# EAGLE design IMU (EAGLE 9.6.2)
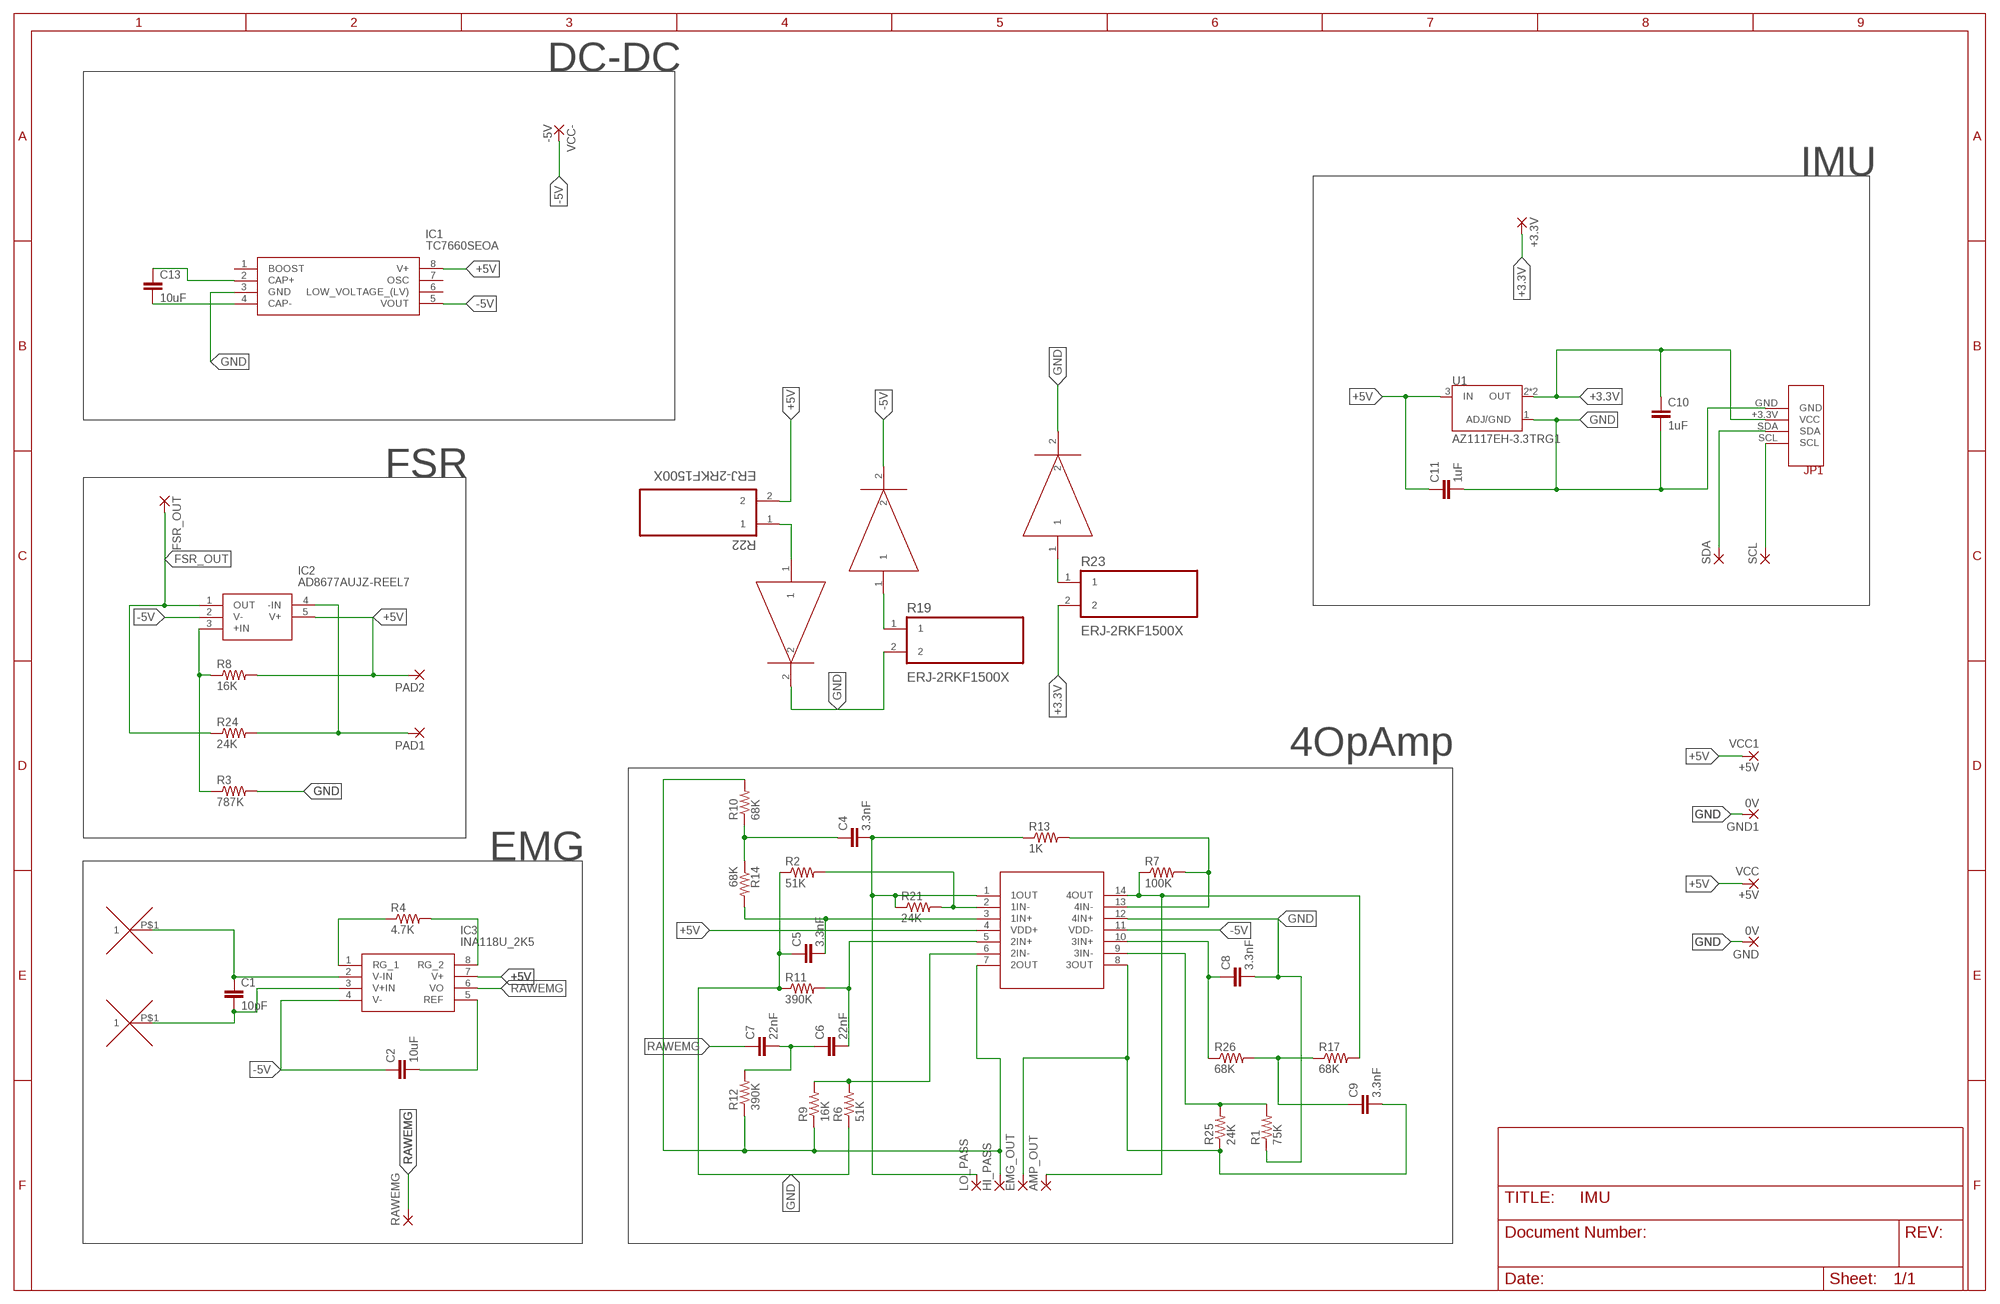
[diagram p0: schematic, sheet 1]

## Parts
+3.3V  1,6/0,8  [1,6/0,8]
AMP_OUT  1,6/0,8  [1,6/0,8]
BLUE  RESC0402X40N  [RESC0402X40N]
C1  10pF  C-EUHPC0201  [HPC0201]
C2  10uF  C-EUC0805  [C0805]
C4  3.3nF  C-EUC1206  [C1206]
C5  3.3nF  C-EUC1206  [C1206]
C6  22nF  C-EUC0805  [C0805]
C7  22nF  C-EUC0805  [C0805]
C8  3.3nF  C-EUC1206  [C1206]
C9  3.3nF  C-EUC1206  [C1206]
C10  1uF  C-EUC0402  [C0402]
C11  1uF  C-EUC0402  [C0402]
C13  10uF  C-EUC0805K  [C0805K]
EMG_OUT  1,6/0,8  [1,6/0,8]
FSR_OUT  1,6/0,8  [1,6/0,8]
GND  0V  1,6/0,8  [1,6/0,8]
GND1  0V  1,6/0,8  [1,6/0,8]
HI_PASS  1,6/0,8  [1,6/0,8]
IC1  TC7660SEOA  [SOIC127P600X175-8N]
IC2  AD8677AUJZ-REEL7  [SOT95P280X100-5N]
IC3  INA118U_2K5  [SOIC127P600X175-8N]
IMU  IMU  [IMU]
LO_PASS  1,6/0,8  [1,6/0,8]
ORANGE  RESC0402X40N  [RESC0402X40N]
PAD1  SMD2  [SMD1,27-2,54]
PAD2  SMD2  [SMD1,27-2,54]
R1  75K  R-US_R0402  [R0402]
R2  51K  R-US_R0402  [R0402]
R3  787K  R-US_R0805  [R0805]
R4  4.7K  R-US_R0402  [R0402]
R6  51K  R-US_R0402  [R0402]
R7  100K  R-US_R1005  [R1005]
R8  16K  R-US_R0402  [R0402]
R9  16K  R-US_R0402  [R0402]
R10  68K  R-US_R0402  [R0402]
R11  390K  R-US_R0603  [R0603]
R12  390K  R-US_R0603  [R0603]
R13  1K  R-US_R0402  [R0402]
R14  68K  R-US_R0402  [R0402]
R17  68K  R-US_R0402  [R0402]
R19  ERJ-2RKF1500X  [RESC1005X40N]
R21  24K  R-US_R0402  [R0402]
R22  ERJ-2RKF1500X  [RESC1005X40N]
R23  ERJ-2RKF1500X  [RESC1005X40N]
R24  24K  R-US_R0402  [R0402]
R25  24K  R-US_R0402  [R0402]
R26  68K  R-US_R0402  [R0402]
RAWEMG  1,6/0,8  [1,6/0,8]
RED  RESC0402X40N  [RESC0402X40N]
SCL  1,6/0,8  [1,6/0,8]
SDA  1,6/0,8  [1,6/0,8]
U1  AZ1117EH-3.3TRG1  [SOT230P700X180-4N]
U$1  TLC2274-HT  [SOP65P640X120-14N]
U$2  EMG_VIA  [EMG_VIA]
U$3  EMG_VIA  [EMG_VIA]
VCC  +5V  1,6/0,8  [1,6/0,8]
VCC1  +5V  1,6/0,8  [1,6/0,8]
VCC-  -5V  1,6/0,8  [1,6/0,8]

## Nets
+3.3V: +3.3V.1(P) C10.1 IMU.+3.3V(VCC) R23.2 U1.2(OUT) U1.4(OUT)
+5V: C11.1 IC1.8(V+) IC2.5(V+) IC3.7(V+) PAD2.1(P) R8.2 R22.2 U1.3(IN) U$1.4(VDD+) VCC1.1(P) VCC.1(P)
-5V: BLUE.2 C2.1 IC1.5(VOUT) IC2.2(V-) IC3.4(V-) U$1.11(VDD-) VCC-.1(P)
EMG_BASIC: C9.2 EMG_OUT.1(P) R25.1 U$1.8(3OUT)
FSR_OUT: FSR_OUT.1(P) IC2.1(OUT) R24.1
GND: C5.1 C8.2 C10.2 C11.2 GND1.1(P) GND.1(P) IC1.3(GND) IMU.GND ORANGE.2 R1.1 R2.1 R3.2 R6.1 R11.1 R19.2 RED.2 U1.1(ADJ/GND) U$1.12(4IN+)
N$1: C13.1 IC1.2(CAP+)
N$2: C13.2 IC1.4(CAP-)
N$3: C1.1 IC3.2(V-IN) U$2.P$1
N$4: R22.1 RED.1
N$5: C1.2 IC3.3(V+IN) U$3.P$1
N$6: BLUE.1 R19.1
N$7: IC2.4(-IN) PAD1.1(P) R24.2
N$9: ORANGE.1 R23.1
N$10: IC2.3(+IN) R3.1 R8.1
N$11: C2.2 IC3.5(REF)
N$12: IC3.1(RG_1) R4.1
N$13: IC3.8(RG_2) R4.2
N$14: C4.2 LO_PASS.1(P) R13.1 R21.1 U$1.1(1OUT)
N$16: IMU.SDA SDA.1(P)
N$17: AMP_OUT.1(P) R7.1 R17.2 U$1.14(4OUT)
N$18: R7.2 R13.2 U$1.13(4IN-)
N$19: R2.2 R21.2 U$1.2(1IN-)
N$20: C5.2 R14.2 U$1.3(1IN+)
N$21: C4.1 R10.1 R14.1
N$22: IMU.SCL SCL.1(P)
N$23: C6.1 C7.2 R12.2
N$24: C6.2 R11.2 U$1.5(2IN+)
N$26: R6.2 R9.2 U$1.6(2IN-)
N$27: C9.1 R17.1 R26.2
N$28: C8.1 R26.1 U$1.10(3IN+)
N$30: R1.2 R25.2 U$1.9(3IN-)
PIN7: HI_PASS.1(P) R9.1 R10.2 R12.1 U$1.7(2OUT)
RAWEMG: C7.1 IC3.6(VO) RAWEMG.1(P)
Unconnected: IC1.1(BOOST) IC1.6(LOW_VOLTAGE_(LV)) IC1.7(OSC)

## Notes on the sheet
- DC-DC
- IMU
- FSR
- 4OpAmp
- EMG

## Library data of the parts
+3.3V AMP_OUT EMG_OUT FSR_OUT GND GND1 HI_PASS LO_PASS RAWEMG SCL SDA VCC VCC1 VCC- = wirepad:1,6/0,8: THROUGH-HOLE PAD
BLUE ORANGE RED = RESC0402X40N:RESC0402X40N; A_MAX: 0.4; A_MIN: 0.4; A_NOM: 0.4; D_MAX: 1.1; D_MIN: 0.95; D_NOM: 1.0; E_MAX: 0.55; E_MIN: 0.45; E_NOM: 0.5; L1_MAX: 0.3; L1_MIN: 0.15; L1_NOM: 0.25; L_MAX: 0.3; L_MIN: 0.15; L_NOM: 0.25; MANUFACTURER: KOA; STANDARD: IPC 7351B
C1 C2 C4-C11 C13 = rcl:C-EU: CAPACITOR, European symbol; SPICEPREFIX: C
IC1 = TC7660SEOA:TC7660SEOA: DC-TO-DC VOLTAGE CONVERTER Source: Datasheet <http://componentsearchengine.com/Datasheets/1/TC7660SEOA.pdf>; ARROW_PART_NUMBER: TC7660SEOA; ARROW_PRICE-STOCK: https://www.arrow.com/en/products/tc7660seoa/microchip-technology; DESCRIPTION: DC-TO-DC VOLTAGE CONVERTER; HEIGHT: 1.75mm; MANUFACTURER_NAME: Microchip; MANUFACTURER_PART_NUMBER: TC7660SEOA; MOUSER_PART_NUMBER: 579-TC7660SEOA; MOUSER_PRICE-STOCK: https://www.mouser.co.uk/ProductDetail/Microchip-Technology/TC7660SEOA?qs=cQYLKLPzRJl3hJI5k2EAHg%3D%3D
IC2 = AD8677AUJZ-REEL7:AD8677AUJZ-REEL7: Precision Amplifiers 130uV Max Offset VTG Source: Datasheet <http://www.analog.com/media/en/technical-documentation/data-sheets/AD8677.pdf>; ARROW_PART_NUMBER: AD8677AUJZ-REEL7; ARROW_PRICE-STOCK: https://www.arrow.com/en/products/ad8677aujz-reel7/analog-devices; DESCRIPTION: Precision Amplifiers 130uV Max Offset VTG; HEIGHT: 1mm; MANUFACTURER_NAME: Analog Devices; MANUFACTURER_PART_NUMBER: AD8677AUJZ-REEL7; MOUSER_PART_NUMBER: 584-AD8677AUJZ-R7; MOUSER_PRICE-STOCK: https://www.mouser.co.uk/ProductDetail/Analog-Devices/AD8677AUJZ-REEL7?qs=%2FtpEQrCGXCxIKHu%2FfOAijA%3D%3D
IC3 = INA118U_2K5:INA118U_2K5: Precision, Low Power Instrumentation Amplifier Source: Datasheet <http://www.ti.com/lit/gpn/INA118>; ARROW_PART_NUMBER: INA118U/2K5; ARROW_PRICE-STOCK: https://www.arrow.com/en/products/ina118u2k5/texas-instruments; DESCRIPTION: Precision, Low Power Instrumentation Amplifier; HEIGHT: 1.75mm; MANUFACTURER_NAME: Texas Instruments; MANUFACTURER_PART_NUMBER: INA118U/2K5; MOUSER_PART_NUMBER: 595-INA118U/2K5; MOUSER_PRICE-STOCK: https://www.mouser.co.uk/ProductDetail/Texas-Instruments/INA118U-2K5?qs=VBduBm9rCJRVtE6eJbSA%2Fg%3D%3D
IMU = IMU:IMU
PAD1 PAD2 = wirepad:SMD2: SMD PAD
R1 R2 R6 R8-R11 R13 R14 R17 R21 R24-R26 = adafruit:R-US_: RESISTOR, American symbol
R3 = rcl:R-US_: RESISTOR, American symbol; SPICEPREFIX: R
R4 R7 R12 = adafruit@1:R-US_: RESISTOR, American symbol
R19 R22 R23 = ERJ-2RKF1500X:ERJ-2RKF1500X; DESCRIPTION: 150 Ohms ±1% 0.1W, 1/10W Chip Resistor 0402 (1005 Metric) Automotive AEC-Q200 Thick Film; DIGI-KEY_PART_NUMBER: P150LCT-ND; MF: Panasonic Electronic; MP: ERJ-2RKF1500X; PACKAGE: 1005 Panasonic Electronic Components; PURCHASE-URL: https://pricing.snapeda.com/search/part/ERJ-2RKF1500X/?ref=eda
U1 = AZ1117EH-3.3TRG1:AZ1117EH-3.3TRG1: Ldo.Vreg Pos 3, 3v 1a Sot223; DESCRIPTION: Linear Voltage Regulator IC 1 Output 1A SOT-223; DIGI-KEY_PART_NUMBER: AZ1117EH-3.3TRG1DICT-ND; MF: Diodes Inc.; MP: AZ1117EH-3.3TRG1; PACKAGE: SOT-223 Diodes Inc.; PURCHASE-URL: https://pricing.snapeda.com/search/part/AZ1117EH-3.3TRG1/?ref=eda
U$1 = TLC2274-HT:TLC2274-HT
U$2 U$3 = EMG_VIA:EMG_VIA

## Board
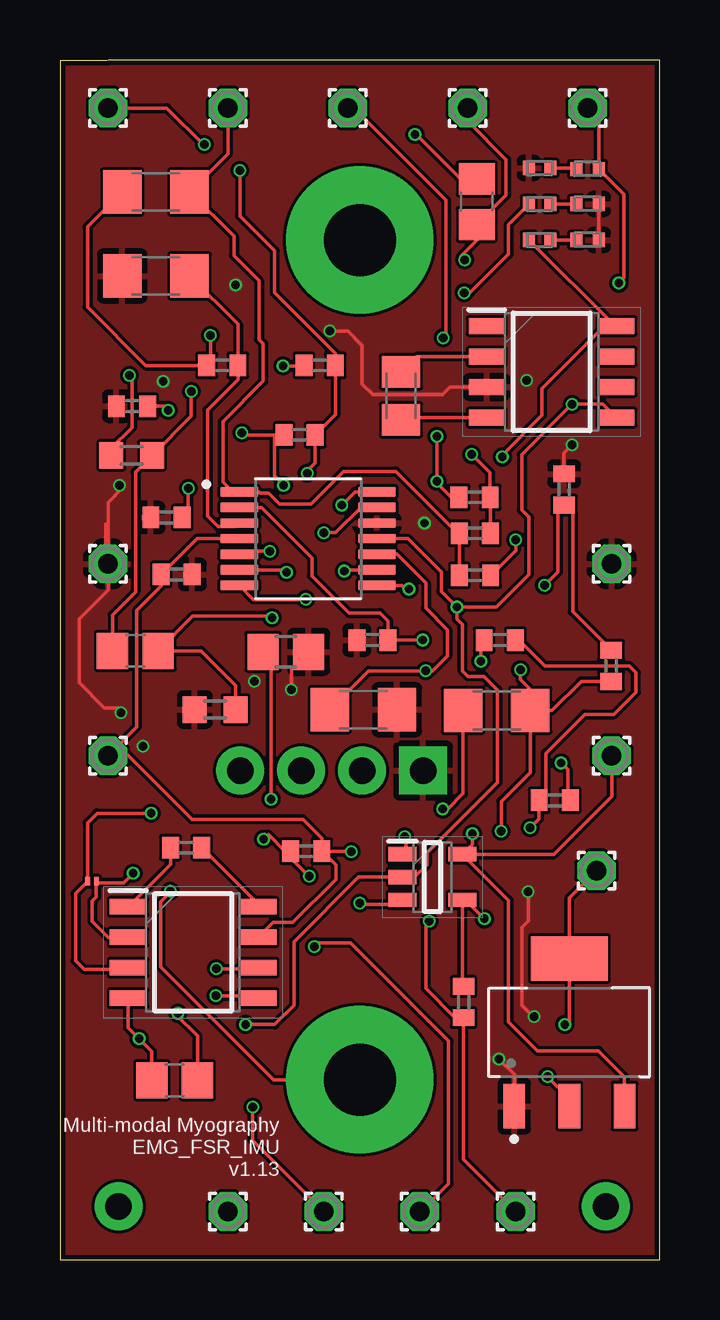
[diagram p1: board, top side]
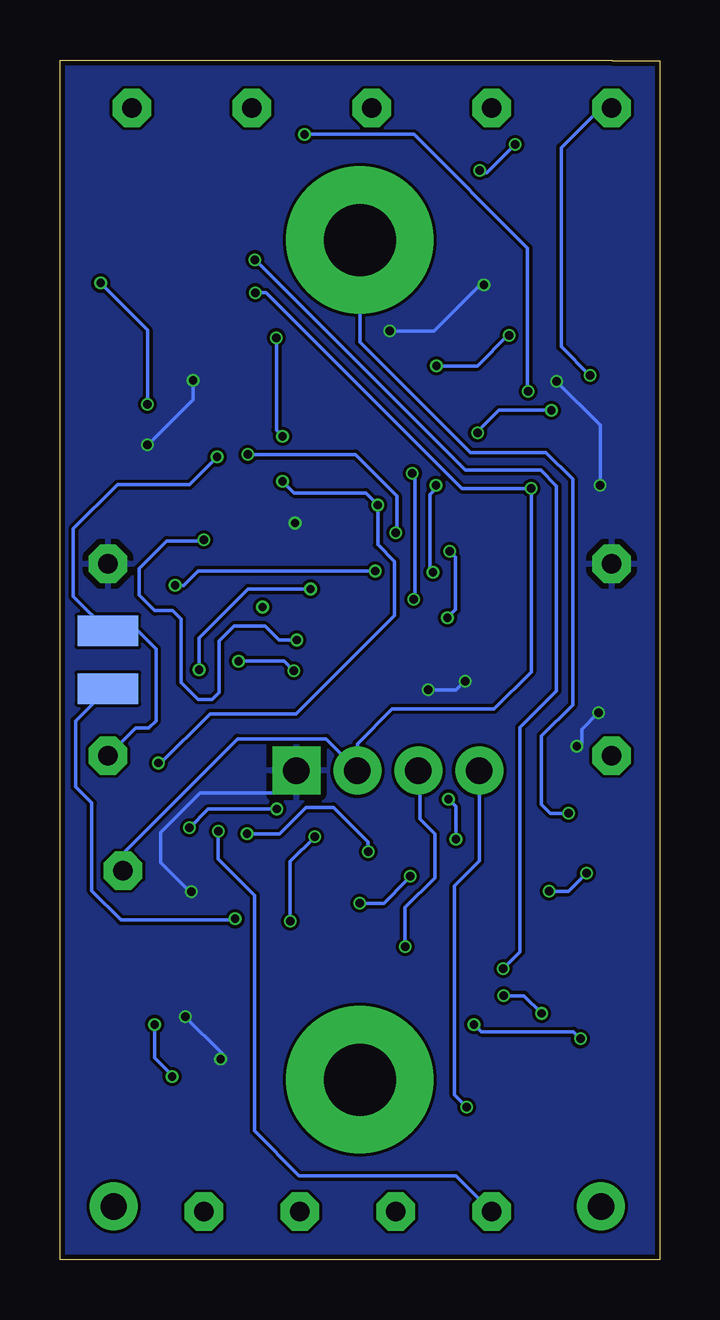
[diagram p2: board, bottom side, seen from below]

Size 25 x 50 mm. Coordinates in mm from the lower left corner, seen from the top.
Outline: 0,0 25,0 25,50 2,50 1.97,49.97 0,49.97 0,0
Copper layers (1*16): Top 0.035559375mm / dielectric 1.6mm / Bottom 0.035559375mm
Design rules "jlcpcb2layer": minimum track width 5mil, minimum drill 12mil, track to track 5mil, track to pad 5mil, pad to pad 5mil, via to via 5mil, smd to smd 5mil, copper to edge 8mil, drill to drill 6mil, minimum pad ring 5mil, minimum via ring 3mil, stop-mask expansion 2.5mil, vias tented up to drill 0mil, thermal gap 10mil

### Footprints (pad centres in the part's own frame; a part is rotated, then mirrored left to right if it is on the bottom)
1,6/0,8 = drill 0.813 pad 1.6 octagon: 1 0,0
RESC0402X40N = smd 0.51 x 0.6: 1 -0.465,0; 2 0.465,0
HPC0201 = smd 0.2 x 0.35: 1 -0.18,0; 2 0.18,0
C0805 = smd 1.3 x 1.5: 1 -0.95,0; 2 0.95,0
C1206 = smd 1.6 x 1.8: 1 -1.4,0; 2 1.4,0
C0402 = smd 0.7 x 0.9: 1 -0.65,0; 2 0.65,0
C0805K = smd 1.3 x 1.6: 1 -1,0; 2 1,0
SOIC127P600X175-8N = smd 1.5 x 0.65: 1 -2.7,1.905; 2 -2.7,0.635; 3 -2.7,-0.635; 4 -2.7,-1.905; 5 2.7,-1.905; 6 2.7,-0.635; 7 2.7,0.635; 8 2.7,1.905
SOT95P280X100-5N = smd 1.15 x 0.6: 1 -1.25,0.95; 2 -1.25,0; 3 -1.25,-0.95; 4 1.25,-0.95; 5 1.25,0.95
SOIC127P600X175-8N' = smd 1.528 x 0.65: 1 -2.711,1.905; 2 -2.711,0.635; 3 -2.711,-0.635; 4 -2.711,-1.905; 5 2.711,-1.905; 6 2.711,-0.635; 7 2.711,0.635; 8 2.711,1.905
IMU = drill 1.1 pad 2: +3.3V -14.097,0; P$1 4.064,10.16; P$2 4.064,-10.16; SCL -14.097,-5.08; SDA -14.097,-2.54 | drill 1.1 pad 2 square: GND -14.097,2.54
SMD1,27-2,54 = smd 1.27 x 2.54: 1 0,0
R0402 = smd 0.7 x 0.9: 1 -0.65,0; 2 0.65,0
R0805 = smd 1.3 x 1.5: 1 -0.95,0; 2 0.95,0
R1005 = smd 0.7 x 0.9: 1 -0.65,0; 2 0.65,0
R0603 = smd 1 x 1.1: 1 -0.85,0; 2 0.85,0
RESC1005X40N = smd 0.51 x 0.6: 1 -0.445,0; 2 0.445,0
SOT230P700X180-4N = smd 1.86 x 0.9: 1 -3.075,2.3; 2 -3.075,0; 3 -3.075,-2.3 | smd 1.86 x 3.19: 4 3.075,0
SOP65P640X120-14N = smd 1.57 x 0.41: 1 -2.87,1.95; 2 -2.87,1.3; 3 -2.87,0.65; 4 -2.87,0; 5 -2.87,-0.65; 6 -2.87,-1.3; 7 -2.87,-1.95; 8 2.87,-1.95; 9 2.87,-1.3; 10 2.87,-0.65; 11 2.87,0; 12 2.87,0.65; 13 2.87,1.3; 14 2.87,1.95
EMG_VIA = drill 3 pad 6.15: P$1 0,0

### Placement (x,y rotation side)
+3.3V  22.37,16.21 0 top
AMP_OUT  12,48 0 top
BLUE  22,45.45 0 top
C1  1.34,15.77 180 top
C2  4.78,7.47 0 top
C4  4,44.5 0 top
C5  4,41 0 top
C6  3.14,25.37 0 top
C7  17.38,44.09 90 top
C8  12.65,22.92 0 top
C9  18.21,22.89 0 top
C10  4.44,30.93 180 top
C11  4.87,28.55 0 top
C13  14.22,36 270 top
EMG_OUT  7,2 0 top
FSR_OUT  19,2 0 top
GND  2,29 0 top
GND1  23,29 0 top
HI_PASS  2,48 0 top
IC1  20.5,37 0 top
IC2  15.53,15.94 0 top
IC3  INA118U_2K5  [SOIC127P600X175-8N']  5.55,12.8 0 top
IMU  12.6,6.28 270 top
LO_PASS  7,48 0 top
ORANGE  22,44 0 top
PAD1  23,23.8 270 bottom
PAD2  23,26.2 270 bottom
R1  21.02,32.1 270 top
R2  13.03,25.82 0 top
R3  9.42,25.33 0 top
R4  5.26,17.17 0 top
R6  3,35.57 0 top
R7  17.29,31.77 0 top
R8  10.27,17.02 0 top
R9  9.99,34.37 180 top
R10  10.83,37.27 0 top
R11  6.47,22.92 0 top
R12  2.99,33.52 0 top
R13  17.3,30.27 0 top
R14  6.77,37.27 0 top
R17  20.62,19.14 0 top
R19  20,45.5 180 top
R21  17.31,28.52 0 top
R22  20,42.5 180 top
R23  20,44 180 top
R24  16.83,10.73 90 top
R25  22.98,24.75 90 top
R26  18.34,25.82 0 top
RAWEMG  17,48 0 top
RED  22,42.5 0 top
SCL  11,2 0 top
SDA  15,2 0 top
U1  21.24,9.47 90 top
U$1  10.35,30.05 0 top
U$2  12.5,7.5 0 top
U$3  12.5,42.5 0 top
VCC  2,21 0 top
VCC1  23,21 0 top
VCC-  22,48 0 top

### Tracks (layer width: path | path; a pad name or v marks a point on that pad's centre or on a via)
+3.3V  (via drill 0.35)
  Top 0.152: R23.2 18.7,43.15 18.7,41.9 17.1,40.3 v16.85,40.3 | v5.35,32.15 5.35,31.24 5.09,30.98 C10.1 | +3.3V.1 21.24,15.08 U1.4 21.24,9.79 21.15,9.7 v21.05,9.8 | v20.32,7.62 21.24,6.71 U1.2
  Bottom 0.152: v16.85,40.3 16.4,40.3 8.24,32.15 v5.36,32.15 v5.35,32.15 5.35,24.5 6.9,22.95 11.15,22.95 12.6,21.5 12.6,20.4 | v21.05,9.8 21.05,8.4 20.3,7.65 v20.32,7.62 | 12.6,20.4 IMU.+3.3V | +3.3V.1 22.37,16.93 17.6,21.7 13.9,21.7 12.6,20.4
+5V  (via drill 0.35)
  Top 0.152: v18.45,33.45 18.4,33.5 20.1,35.2 20.1,36.3 22.7,38.91 IC1.8 23.15,38.91 R22.2 | VCC1.1 23,19.3 20.59,16.89 IC2.5 | IC2.5 18.7,14.97 18.7,9.9 19.9,8.7 22.45,8.7 23.54,7.61 U1.3 | VCC.1 2.02,21.02 | 2.02,21.02 3.2,22.2 3.2,27.05 4.21,28.07 C11.1 5.71,30.05 U$1.4 | IC3.7 8.88,14.05 9.7,14.05 11.5,15.85 11.5,16.44 R8.2 | R8.2 12.13,17.02 v12.15,17 | IC2.5 17.2,17.31 v17.2,17.75 | R8.2 10.92,17.56 10.13,18.35 5.5,18.35 2.83,21.02 2.02,21.02
  Bottom 0.152: v17.2,17.75 15.85,17.75 14.75,18.85 13.6,18.85 12.15,17.4 v12.15,17 | v18.45,33.45 19.6,32.3 22.6,32.3 24.44,30.46 24.44,27.64 PAD2.1 21.75,26.2 21,25.45 21,22.45 21.3,22.15 21.85,22.15 VCC1.1
-5V  (via drill 0.35)
  Top 0.152: VCC-.1 22.46,47.53 BLUE.2 23.5,44.41 23.5,40.9 v23.3,40.7 | IC1.5 22.64,35.65 v21.35,35.65 19.25,33.55 19.25,31.25 19.55,30.95 19.55,28.55 18.2,27.2 v16.55,27.2 | v7.74,9.8 8.96,9.8 9.75,10.6 9.75,13.25 12.44,15.94 IC2.2 14.79,15.94 15.3,16.45 15.3,16.95 18.24,19.89 18.24,23.75 17.68,24.31 17.01,24.31 16.78,24.54 16.78,26.47 16.55,26.7 v16.55,27.2 | IC3.4 2.84,9.66 v3.3,9.2 3.83,8.67 C2.1 | v16.55,27.2 15.9,27.85 15.9,28.65 14.5,30.05 U$1.11
  Bottom 0.152: v23.3,40.7 21.35,38.75 v21.35,35.65 | v7.74,9.8 7.43,9.49 3.59,9.49 v3.3,9.2
EMG_BASIC  (via drill 0.35)
  Top 0.152: C9.2 20.52,22.89 21.73,24.1 R25.1 | C9.2 19.61,20.31 18.4,19.1 v18.4,17.85 | U$1.8 14.25,28.1 14.45,27.9 14.5,27.9 v14.55,27.95 | v19.2,24.58 19.2,24.18 19.61,23.77 C9.2
  Bottom 0.152: v18.4,17.85 18.4,16.7 16.88,15.18 16.88,5.36 15.03,3.5 8.5,3.5 EMG_OUT.1 | v19.2,24.58 19.2,25.9 17.15,27.95 v14.55,27.95
FSR_OUT  (via drill 0.35)
  Top 0.152: FSR_OUT.1 16.83,4.17 R24.1 16.48,10.08 15.25,11.3 15.25,14.1 v15.4,14.1 | v14.38,17.62 14.43,17.57 14.43,17.04 IC2.1
  Bottom 0.152: v15.4,14.1 15.4,16.6 v14.38,17.62
GND  (via drill 0.35)
  Top 0.152: ORANGE.2 RED.2 | R3.2 9.65,24.61 v9.65,23.75 | v8.1,24.1 8.1,24.05 8.15,24 | R1.1 21.02,33.62 v21.35,33.95 | GND.1 2,30.55 1.9,30.65 1.9,29.1 GND.1 | GND.1 2,31.55 2.6,32.15 v2.48,32.27 | v19.52,15.32 19.52,14.12 19.25,13.85 19.25,10.6 19.75,10.1 v19.77,10.12 | v18.3,8.35 18.94,7.71 U1.1 | IC1.3 16.27,36.37 15.95,36.05 13.05,36.05 12.6,36.5 12.6,38.1 12,38.7 v11.25,38.7 | GND.1 2,27.9 0.8,26.7 0.8,24.05 1.85,23 2.55,23 v2.55,22.8
  Bottom 0.152: v9.65,23.75 8.5,23.75 8.15,24.1 v8.1,24.1 | v21.35,33.95 19.45,35.85 v19.45,36.65 | v2.48,32.27 2.48,34.77 v4.3,36.6 | IMU.GND 16.07,19.45 19.15,19.45 20.8,17.8 20.8,16.55 19.55,15.3 v19.52,15.32 | v19.77,10.12 18.25,8.6 18.25,8.35 v18.3,8.35 | v11.25,38.7 9.4,38.7 7.4,40.7 v7.33,40.62 | v2.55,22.8 3.25,22.1 3.25,21.4 v3.45,21.4
  other vias: 15.2,30.7
  pour Top: 0,49.95 0,0 25,0 25,50 0,50
  pour Bottom: 0,49.95 0,0 0.05,0 25,0 25,50 0,50
N$1
  Top 0.152: IC1.2 14.86,37.63 C13.1
N$2
  Top 0.152: IC1.4 14.31,35.09 C13.2
N$3  (via drill 0.35)
  Top 0.152: U$2.P$1 8.9,7.5 4.2,12.2 4.2,14.9 4.6,15.3 v4.6,15.35 | v3.05,16.1 2.65,15.7 1.59,15.7 C1.1 1.52,15.12 1.35,14.95 1.35,14.1 2.02,13.44 IC3.2
  Bottom 0.152: v4.6,15.35 3.8,15.35 v3.05,16.1
N$4
  Top 0.152: R22.1 RED.1
N$5  (via drill 0.35)
  Top 0.152: v3.8,18.6 1.55,18.6 1.15,18.2 1.15,15.91 1.16,15.9 C1.2 0.65,15.26 0.65,12.45 1,12.1 2.77,12.1 IC3.3 | U$3.P$1 12.8,42.2 12.8,42.05 12.5,42.35 U$3.P$1
  Bottom 0.152: U$3.P$1 12.5,38.25 7.88,33.63 4.74,33.63 3.62,32.52 3.62,23.12 4.92,21.82 4.92,18.98 4.55,18.6 v3.8,18.6
N$6
  Top 0.152: R19.1 21.48,45.5 BLUE.1
N$7  (via drill 0.35)
  Top 0.152: R24.2 16.78,11.43 IC2.4 16.91,14.99 v17.7,14.2
  Bottom 0.152: v17.7,14.2 17.7,14.15 22.45,14.15 23.68,15.38 23.68,19.02 24.35,19.7 24.35,22.45 PAD1.1
N$9
  Top 0.152: R23.1 ORANGE.1
N$10  (via drill 0.35)
  Top 0.152: IC2.3 14.09,14.8 12.5,14.8 v12.5,14.85 | v10.39,15.97 9.62,16.75 R8.1 9.38,17.02 8.69,17.71 v8.49,17.52 | v8.8,19.2 8.8,25 R3.1
  Bottom 0.152: v12.5,14.85 11.5,14.85 10.55,15.8 10.55,15.82 v10.39,15.97 | v8.49,17.52 8.49,18.89 v8.8,19.2
N$11  (via drill 0.35)
  Top 0.152: C2.2 5.73,9.32 4.85,10.2 v4.92,10.26 | v6.5,11 8.16,11 IC3.5
  Bottom 0.152: v4.92,10.26 5.66,11 v6.5,11
N$12
  Top 0.152: IC3.1 4.61,16.48 R4.1
N$13
  Top 0.152: R4.2 8.26,14.82 IC3.8
N$14
  Top 0.152: LO_PASS.1 7,46.1 C4.2 7.25,42.65 7.25,41.85 8.3,40.8 8.3,38.35 8.47,38.17 8.47,36.6 6.8,34.93 6.8,32.4 7.2,32 U$1.1 8.3,32 8.35,31.95 8.7,31.95 9.15,31.5 10.46,31.5 11.81,32.85 14.01,32.85 16.59,30.27 R13.1 R21.1
N$16  (via drill 0.35)
  Top 0.152: SDA.1 15.04,2 16.2,3.16 16.2,9.11 12.11,13.2 10.7,13.2 10.61,13.12 v10.61,13.04
  Bottom 0.152: v10.61,13.04 10.61,14.68 9.38,15.91 9.38,17.75 9.98,18.36 9.98,20.3 IMU.SDA
N$17  (via drill 0.35)
  Top 0.152: AMP_OUT.1 12.25,48 16.1,44.15 16.1,38.6 15.95,38.45 v15.97,38.42 | v11.75,31.45 12.3,32 U$1.14 | v20.9,20.7 21.18,20.43 21.18,19.24 R17.2 | v15.72,34.31 v15.72,32.44 15.72,32.37 16.32,31.77 R7.1
  Bottom 0.152: v15.72,32.44 15.23,31.95 12.25,31.95 v11.75,31.45 11.75,29.8 11.05,29.1 11.05,26.85 15.15,22.75 18.75,22.75 20.85,20.65 v20.9,20.7 | v15.97,38.42 15.97,34.58 v15.72,34.32 v15.72,34.31
N$18  (via drill 0.35)
  Top 0.152: R13.2 R7.2 17.93,32.8 v17.17,33.55 | v10.99,30.3 11.49,30.3 12.55,31.35 U$1.13
  Bottom 0.152: v17.17,33.55 12.68,33.55 10.95,31.82 10.95,30.34 v10.99,30.3
N$19  (via drill 0.35)
  Top 0.152: U$1.2 8.4,31.35 10.5,29.25 10.5,28.5 12.05,26.95 13.35,26.95 13.68,26.62 R2.2 v15.12,25.82 | v19,30 19,29.56 R21.2
  Bottom 0.152: v15.12,25.82 15.88,25.82 16.45,26.4 17.75,26.4 18.36,25.79 18.36,23.64 18.65,23.35 19.25,23.35 19.95,24.05 19.95,26.7 20.3,27.05 21.05,27.05 21.7,27.7 21.7,28.8 20.55,29.95 19.05,29.95 v19,30
N$20
  Top 0.152: C5.2 7.42,38.98 R14.2 7.42,36.69 6.15,35.41 6.15,31 6.6,30.55 7.33,30.55 U$1.3
N$21  (via drill 0.35)
  Top 0.152: C4.1 1.15,43.05 1.15,39.7 3.58,37.27 R14.1 6.28,37.42 v6.28,38.52 | R10.1 10.16,37.25 v9.3,37.25
  Bottom 0.152: v9.3,37.25 7.6,37.25 6.3,38.55 v6.28,38.52
N$22  (via drill 0.35)
  Top 0.152: SCL.1 8.04,4.96 v8.04,6.35
  Bottom 0.152: v8.04,6.35 8.55,6.86 8.55,15.57 7.52,16.61 IMU.SCL
N$23  (via drill 0.35)
  Top 0.152: C7.2 16.71,45.04 14.85,46.9 v14.8,46.9 | v5.47,36.19 5.47,35.16 R12.2 3.15,32.83 3.15,27.83 2.19,26.87 C6.1
  Bottom 0.152: v14.8,46.9 10.25,46.9 5.51,42.16 5.51,36.19 v5.47,36.19
N$24  (via drill 0.35)
  Top 0.152: R11.2 7.32,23.93 5.88,25.37 C6.2 5.54,26.82 8.78,26.82 v8.85,26.75 | U$1.5 7.61,29.52 v8.76,29.52
  Bottom 0.152: v8.76,29.52 8.51,29.27 8.51,27.09 v8.85,26.75
N$26  (via drill 0.35)
  Top 0.152: v7.59,34.46 7.68,34.37 R9.2 8.95,34.37 8.95,32.65 v9.32,32.27 | U$1.6 9.35,28.75 v9.45,28.65 | v4.51,35.4 4.34,35.57 R6.2
  Bottom 0.152: v7.59,34.46 7.59,34.51 6.7,35.4 v4.51,35.4 | v9.45,28.65 9.57,28.77 9.57,31.89 9.32,32.14 v9.32,32.27
N$27  (via drill 0.35)
  Top 0.152: v19.6,18 19.98,18.38 R17.1 20.25,19.41 20.25,21.1 21.88,22.73 23.09,22.73 24.02,23.64 24.02,24.46 23.73,24.75 20.21,24.75 19.14,25.82 R26.2 | v15.96,18.78 16.17,18.78 16.81,19.42 C9.1
  Bottom 0.152: v19.6,18 18.82,18.78 v15.96,18.78
N$28  (via drill 0.35)
  Top 0.152: U$1.10 14.05,29.4 15.25,28.2 15.25,27.15 16.15,26.25 16.15,25.15 15.54,24.54 v15.26,24.54 12.87,24.54 C8.1 | v17.55,24.95 17.55,25.68 R26.1
  Bottom 0.152: v15.26,24.54 15.66,24.95 v17.55,24.95
N$30  (via drill 0.35)
  Top 0.152: R25.2 21.38,27 21.38,31.09 R1.2 20.77,31.2 20.77,28.66 v20.2,28.1 | v11.85,28.7 11.9,28.75 U$1.9
  Bottom 0.152: v20.2,28.1 19.85,28.1 19.25,28.7 v11.85,28.7
PIN7  (via drill 0.35)
  Top 0.152: v7.5,45.4 7.5,43.5 8.95,42.05 8.95,40.3 11.48,37.77 R10.2 11.48,35.21 R9.1 10.64,33.2 10.26,32.81 v10.3,32.77 | v10.25,27.52 8.06,27.52 U$1.7 | v6.03,46.48 6,46.45 4.45,48 HI_PASS.1 | R12.1 2.14,33.82 3,34.68 3,36.75 v2.9,36.85
  Bottom 0.152: v7.5,45.4 7.5,45.3 7.2,45.3 v6.03,46.48 | v10.3,32.77 10.21,32.66 10.21,27.57 v10.25,27.52 | v2.9,36.85 4.1,38.05 4.1,46.35 2.45,48 HI_PASS.1
RAWEMG  (via drill 0.35)
  Top 0.152: RAWEMG.1 17,47.45 18.6,45.85 18.6,44.36 C7.1 17.38,42.48 16.73,41.83 v16.88,41.67 | v6.53,12.12 8.22,12.12 IC3.6
  Bottom 0.152: v16.88,41.67 8.1,32.9 4.95,32.9 4.3,32.25 4.3,23.7 5.82,22.18 5.82,12.83 v6.53,12.12

### Text on the board
tPlace: Multi-modal Myography / EMG_FSR_IMU / v1.13
tValues: HI_PASS | LO_PASS | AMP_OUT | RAW_EMG | VCC- | 3.3nF | 100R | -5V | 3.3V | 22nF | 100R | 150R | 5V | 3.3nF | TC7760 DC-DC | 68K | 68K | 51K | 16K | 10uF | 390K | TLC2274 4OpAmp | 100K | 75K | 1uF | 1K | GND | GND | 1uF | 24K | 787K | 22nF | 68K | 390K | 3.3nF | 3.3nF | 24K | VCC | VCC | 68K | 10pF | 4.7K | 16K | AD8677 FSR | INA118U EMG | +3.3V | 24K | 10uF | AZ1117 +3.3V | EMG_OUT | SCL | SDA | FSR_OUT